# Altium schematic sheet programmer_adaptor.SchDoc: Programmer Adaptor
size 431 x 279 mm; Date: 19/05/2021; DrawnBy: Steven Wong; SheetNumber: 1; SheetTotal: 1; Project: World Wide Mide; ProjectRev: 02; DocumentRev: A; ItemRev: A
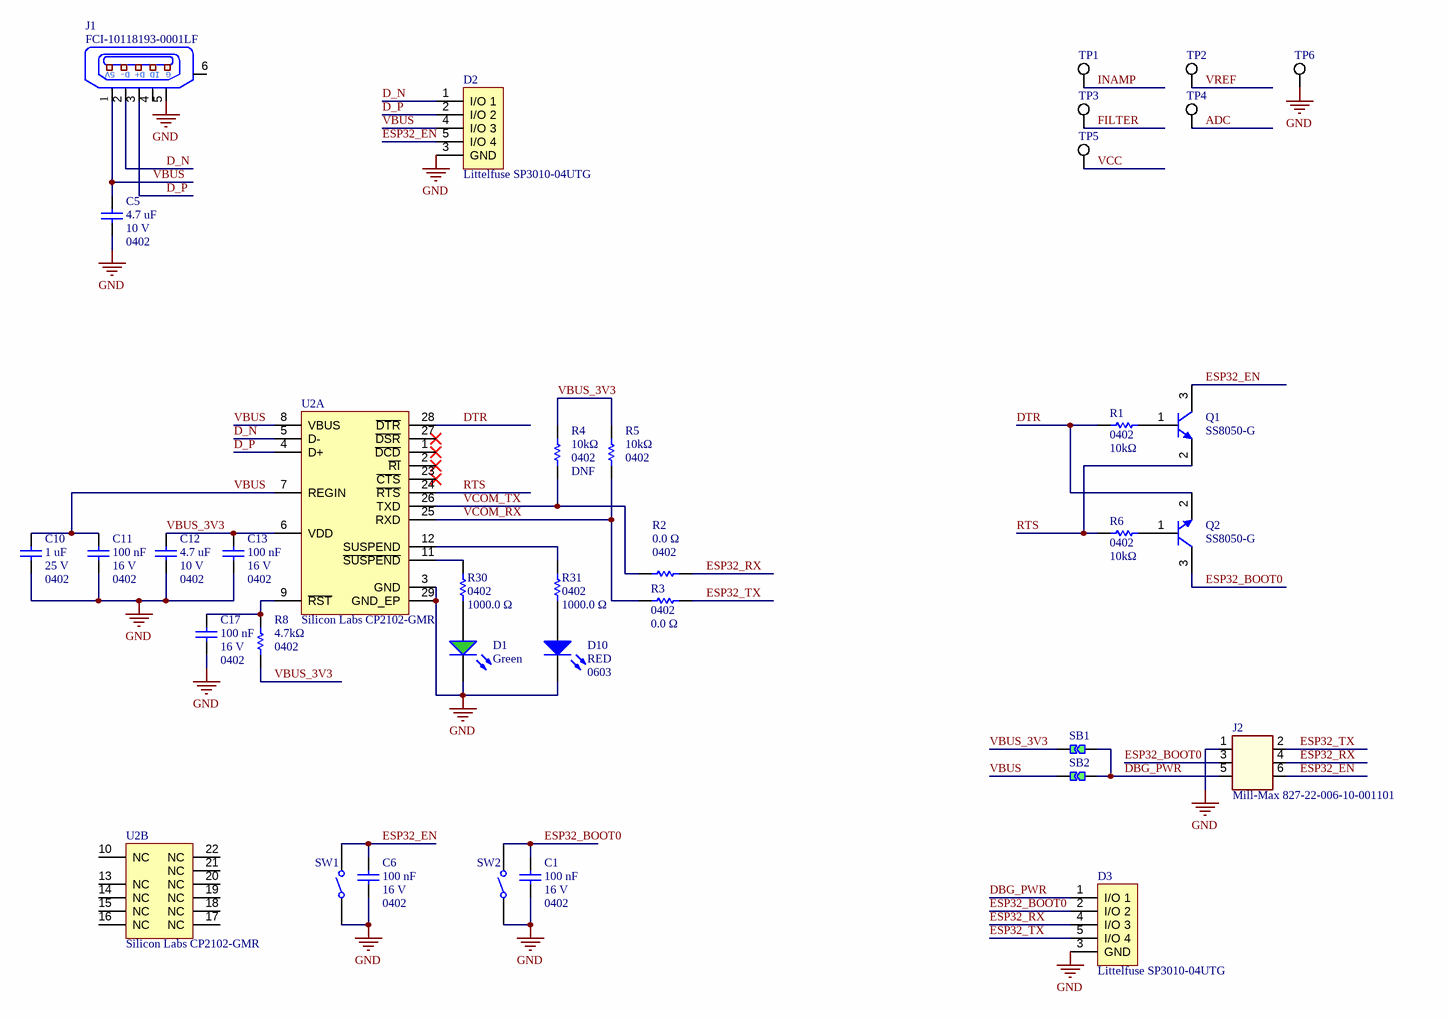
[diagram p0: programmer_adaptor.SchDoc]

## Parts
(Parts that share a designator on the sheet are numbered #1, #2 ... from top to bottom, then left to right.)
C1  Capacitance: 100 nF  Case/Package: 0402  Voltage Rating: 16 V  [CAPC1005X56X25NL10T15]  (hidden comment: 100nF)
C5  Package: 0402  Capacitance: 4.7 uF  Voltage Rating (DC): 10 V  [PCB-ly623x0ckhe065kxsmmc-1]  (hidden comment: Samsung CL05A475MP5NRNC)
C6  Capacitance: 100 nF  Case/Package: 0402  Voltage Rating: 16 V  [CAPC1005X56X25NL10T15]  (hidden comment: 100nF)
C10  Package: 0402  Voltage Rating (DC): 25 V  Capacitance: 1 uF  [PCB-515da9ytrm2wahx6tw11-1]  (hidden comment: Samsung CL05A105KA5NQNC)
C11  Capacitance: 100 nF  Case/Package: 0402  Voltage Rating: 16 V  [CAPC1005X56X25NL10T15]  (hidden comment: 100nF)
C12  Package: 0402  Capacitance: 4.7 uF  Voltage Rating (DC): 10 V  [PCB-ly623x0ckhe065kxsmmc-1]  (hidden comment: Samsung CL05A475MP5NRNC)
C13  Capacitance: 100 nF  Case/Package: 0402  Voltage Rating: 16 V  [CAPC1005X56X25NL10T15]  (hidden comment: 100nF)
C17  Capacitance: 100 nF  Case/Package: 0402  Voltage Rating: 16 V  [CAPC1005X56X25NL10T15]  (hidden comment: 100nF)
D1  Green  [PCB-qrh50x9m6cshxb6d9t7t-1]
D2  Littelfuse SP3010-04UTG  [CAF-50P250X100-10N]
D3  Littelfuse SP3010-04UTG  [CAF-50P250X100-10N]
D10  RED  Case/Package: 0603  [PCB-w5d6ij34fe7jw11ooj6d-1]
J1  FCI-10118193-0001LF  [PCB-no442bxfm6el1a6nc6pa-1]
J2  Mill-Max 827-22-006-10-001101  [PCB-1cajzzw71vgb0kstyzhz-1]
Q1  Manufacturer Part Number: SS8050-G  [PCB-tafg2djhou6mrz6nnzkw-1]  (hidden comment: NPN)
Q2  Manufacturer Part Number: SS8050-G  [PCB-tafg2djhou6mrz6nnzkw-1]  (hidden comment: NPN)
R1  Case/Package: 0402  Resistance: 10kΩ  [RESC1005X40X25NL05T10]  (hidden comment: Yageo / Phycomp RC0402FR-1310KL)
R2  Case/Package: 0402  Resistance: 0.0 Ω  [RESC1005X37X25NL05T10]  (hidden comment: Yageo AC0402JR-070RL)
R3  Case/Package: 0402  Resistance: 0.0 Ω  [RESC1005X37X25NL05T10]  (hidden comment: Yageo AC0402JR-070RL)
R4  Case/Package: 0402  Resistance: 10kΩ  Fit: DNF  [RESC1005X40X25NL05T10]  (hidden comment: Yageo / Phycomp RC0402FR-1310KL)
R5  Case/Package: 0402  Resistance: 10kΩ  [RESC1005X40X25NL05T10]  (hidden comment: Yageo / Phycomp RC0402FR-1310KL)
R6  Case/Package: 0402  Resistance: 10kΩ  [RESC1005X40X25NL05T10]  (hidden comment: Yageo / Phycomp RC0402FR-1310KL)
R8  Case/Package: 0402  Resistance: 4.7kΩ  [RESC1005X40X25NL05T10]  (hidden comment: Vishay Dale CRCW04024K70FKEDHP)
R30  Case/Package: 0402  Resistance: 1000.0 Ω  [RESC1005X40X25LL10T10]  (hidden comment: KOA Speer RK73H1ETTP1001F)
R31  Case/Package: 0402  Resistance: 1000.0 Ω  [RESC1005X40X25LL10T10]  (hidden comment: KOA Speer RK73H1ETTP1001F)
SB1  Solder Bridge 0402  [PCB-zgo6wgtf9tfvr4qcvek3-1]  (value not drawn)
SB2  Solder Bridge 0402  [PCB-zgo6wgtf9tfvr4qcvek3-1]  (value not drawn)
SW1  TS-1185-C-A-A-A  [PCB-qarcnbrnejma51b9hfzm-1]  (value not drawn)
SW2  TS-1185-C-A-A-A  [PCB-qarcnbrnejma51b9hfzm-1]  (value not drawn)
TP1  Keystone Electronics 5002  [TEST_LOOP]  (value not drawn)
TP2  Keystone Electronics 5002  [TEST_LOOP]  (value not drawn)
TP3  Keystone Electronics 5002  [TEST_LOOP]  (value not drawn)
TP4  Keystone Electronics 5002  [TEST_LOOP]  (value not drawn)
TP5  Keystone Electronics 5002  [TEST_LOOP]  (value not drawn)
TP6  Keystone Electronics 5002  [TEST_LOOP]  (value not drawn)
U2#1  Silicon Labs CP2102-GMR  [QFN50P500X500X100_HS-29N]  (part A of 2)
U2#2  Silicon Labs CP2102-GMR  [QFN50P500X500X100_HS-29N]  (part B of 2)

## Nets
GND: C1.2 C5.1 C6.2 C10.1 C11.2 C12.1 C13.2 C17.2 D1.2(K) D2.3(GND) D3.3(GND) D10.2(K) J1.5 J2.1 SW1.1 SW2.1 TP6.1 U2#1.3(GND) U2#1.29(GND_EP)
ADC: TP4.1
D_N: D2.1(I/O_1) J1.2 U2#1.5(D-)
D_P: D2.2(I/O_2) J1.3 U2#1.4(D+)
DBG_PWR: D3.1(I/O_1) J2.5 SB1.2 SB2.2
DTR: Q2.2(E) R1.2 U2#1.28(~{DTR})
ESP32_BOOT0: C1.1 D3.2(I/O_2) J2.3 Q2.3(C) SW2.2
ESP32_EN: C6.1 D2.5(I/O_4) J2.6 Q1.3(C) SW1.2
ESP32_RX: D3.4(I/O_3) J2.4 R2.1
ESP32_TX: D3.5(I/O_4) J2.2 R3.2
FILTER: TP3.1
INAMP: TP1.1
RTS: Q1.2(E) R6.2 U2#1.24(~{RTS})
VBUS: C5.2 C10.2 C11.1 D2.4(I/O_3) J1.1 SB2.1 U2#1.7(REGIN) U2#1.8(VBUS)
VBUS_3V3: C12.2 C13.1 R4.2 R5.2 R8.2 SB1.1 U2#1.6(VDD)
VCC: TP5.1
VCOM_RX: R3.1 R5.1 U2#1.25(RXD)
VCOM_TX: R2.2 R4.1 U2#1.26(TXD)
VREF: TP2.1
NetC17_1: C17.1 R8.1 U2#1.9(~{RST})
NetD1_1: D1.1(A) R30.2
NetD10_1: D10.1(A) R31.2
NetQ1_1: Q1.1(B) R1.1
NetQ2_1: Q2.1(B) R6.1
NetR30_1: R30.1 U2#1.11(~{SUSPEND})
NetR31_1: R31.1 U2#1.12(SUSPEND)

Not connected (* = marked no-connect by the designer): J1 4 6; U2#1 1(~{DCD})* 2(~{RI})* 23(~{CTS})* 27(~{DSR})*; U2#2 10(NC) 13(NC) 14(NC) 15(NC) 16(NC) 17(NC) 18(NC) 19(NC) 20(NC) 21(NC) 22(NC)

## Notes on the sheet
- PROJECT
- TITLE
- PROJECT REVISION:
- DOCUMENT REVISION:
- DATE:
- Drawn by:
- SIZE
- B
- FILE NAME
- SHEET
- OF
- REV
- This work is licensed under a Creative Commons Attribution-ShareAlike 4.0 International License.
- (in symbol CMP-b7d77f99eeaa6810-13) 5V; D-; D+; ID; G

## Library data of the parts
C1 C6 C11 C13 C17 = CMP-bf2276a55d9a60e5-19: Ceramic capacitor SMD-0402 100nF /16V X7R# K +-10%, Samsung, RoHS; Dielectric Characteristic: X7R; Lead-Free Status: Lead Free; Mounting Style: Surface Mount; OctopartID: 0755ced2c795d892; LCSC Part #: C1525
C5 C12 = CMP-45408d1ae5db9a87-3: Cap Ceramic 4.7uF 10V X5R 20% SMD 0402 85°C Paper T/R; Lead-Free Status: Lead Free; Octopart URL: https://octopart.com/cl05a475mp5nrnc-samsung-22054397; Manufacturer Part Number: CL05A475MP5NRNC; RoHS: Compliant; OctopartID: 45408d1ae5db9a87; LCSC Part #: C23733
C10 = CMP-8f214705328650e6-4: Cap Ceramic 1uF 25V X5R 10% SMD 0402 85°C Cardboard T/R; Lead-Free Status: Lead Free; Octopart URL: https://octopart.com/cl05a105ka5nqnc-samsung-19830977; Manufacturer Part Number: CL05A105KA5NQNC; RoHS: Compliant; OctopartID: 8f214705328650e6; LCSC Part #: C52923
D1 = CMP-7093b92408b7af54-1: LED SMD Top View Uni-Color Brilliant Green 518nm 0603 Pkg ø7T/R 3k"; OctopartID: 7093b92408b7af54; Octopart URL: https://octopart.com/19-217%2Fghc-yr1s2%2F3t-everlight-12410178; LCSC Part #: C72043
D2 D3 = CMP-8bbd427616b0547a-5: SP3010 Series 12.3 V 3 A 0.45 pF Quad Uni-Directional TVS Diode Array - UDFN-10; LCSC Part #: C94394
D10 = CMP-a33c6a36c6057cfb-1: Red 0603 1.6 x 0.8 mm 160° Diffused 14 mcd 2 V PCB Chip Surface Mount LED; Manufacturer Part Number: SML-LX0603IW-TR; Wavelength: 635 nm; Lead-Free Status: Lead Free; Case/Package (SI): 1608; Luminous Intensity: 14.0 mcd; Forward Voltage: 2.00 V; RoHS: Compliant; Packaging: Cut Tape (CT), Tape & Reel (TR); Size-Width: 1.60 mm; Peak Wavelength: 635 nm; Viewing Angle: 160 °; Operating Temperature: 85.0 °C (max); Octopart URL: https://octopart.com/sml-lx0603iw-tr-lumex-16479; Number of Pins: 2; Color: Red; OctopartID: a33c6a36c6057cfb; Lens Type: Diffused; LCSC Part #: C2286
J1 = CMP-b7d77f99eeaa6810-13: Conn Micro USB Type B RCP 5 POS 0.65mm Solder RA SMD 5 Terminal 1 Port T/R; RoHS: Compliant; Contact Material: Copper Alloy
J2 = CMP-e3db2be582e23c1c-3: Conn Spring Loaded Connector HDR 6 POS 2.54mm Solder ST Thru-Hole Tube; System: Connector
Q1 Q2 = CMP-1301de72f0beccc6-3: Trans Gp Bjt NPN 25V 1.5A 300MW 3-PIN SOT-23 T/r; Octopart URL: https://octopart.com/ss8050-g-comchip-75089625; OctopartID: 1301de72f0beccc6
  Q1: LCSC Part #: C164886
R1 R4-R6 = CMP-3661304-2: Thick Film Resistors - SMD 10K OHM 1%; Lead-Free Status: Lead Free; Power Rating: 0.0625 W; Voltage Rating (DC): 50.0 V; Mounting Style: Surface Mount; Number of Pins: 2; Octopart Url: https://octopart.com/rc0402fr-1310kl-yageo-42863452; OctopartID: f5673ee3db5d2aa0; Packaging: Cut Tape (CT); Resistance Tolerance: ±1%; RoHS: Compliant; Size-Length: 0.001 m; Manufacturer Part Number: RC0402FR-1310KL; LCSC Part #: C25744
  R1 R5 R6: Fit: Fit
R2 R3 = CMP-1900348-2: RES SMD 0.0 OHM JUMPER 1/16W; Lead-Free Status: Lead Free; Resistance Tolerance: ±5%; Manufacturer Part Number: AC0402JR-070RL; Mounting Style: Surface Mount; Octopart Url: https://octopart.com/ac0402jr-070rl-yageo-21711084; OctopartID: 9e9b56daf311415c; RoHS: Compliant; LCSC Part #: C17168
R8 = CMP-1859046-2: Thick Film Resistors - SMD 1/8watt 4.7Kohms 1% 100ppm High Power; Lead-Free Status: Lead Free; Power Rating: 0.063 W; Octopart Url: https://octopart.com/crcw04024k70fkedhp-vishay+dale-44383120; OctopartID: 931e58b18de84cd9; Resistance Tolerance: ±1%; RoHS: Compliant; Manufacturer Part Number: CRCW04024K70FKEDHP; LCSC Part #: C25900
R30 R31 = CMP-2823544-2: Res Thick Film 0402 1K Ohm 1% 0.063W(1/16W) ±100ppm/C Molded SMD Automotive Punched Paper T/R; Lead-Free Status: Lead Free; Temperature Coefficient: 100.0 ppm/°C; Voltage Rating (DC): 50.0 V; Octopart Url: https://octopart.com/rk73h1ettp1001f-koa+speer-2165773; OctopartID: 54d59dfe7dbe8b12; Power Rating: 0.063 W; Resistance Tolerance: ±1%; RoHS: Compliant; Size-Length: 0.001 m; Size-Width: 0.0005 m; Manufacturer Part Number: RK73H1ETTP1001F; LCSC Part #: C11702
SB1 SB2 = CMP-p5m5ndkvhoystooqawk9-2: Solder Bridge Jumper, can be fitted with 0402 0R resistor for automated production; State: Open / Closed; CustomComponentID: p5m5ndkvhoystooqawk9
SW1 SW2 = CMP-hgui3ccx9uakpoe7vbsx-5: SPST 50mA @ 12VDC Vertical Round Button 260gf SMD Tactile Switches RoHS; Manufacturer: XKB Connectivity; LCSC Part #: C561518; Manufacturer Part Number: TS-1185-C-A-A-A; CustomComponentID: hgui3ccx9uakpoe7vbsx; Homepage URL: https://lcsc.com/product-detail/Tactile-Switches_XKB-Connectivity-TS-1185-C-A-A-A_C561518.html
TP1-TP6 = CMP-954155-2: KEYSTONE   5002   Series:-; Manufacturer Part Number: 5002; Lead-Free Status: Lead Free; Color: White; Contact Material: Phosphor Bronze; Contact Plating: Tin; Octopart Url: https://octopart.com/5002-keystone-5193; OctopartID: f34a3a40c2652c8d; Packaging: Bag; REACH SVHC Compliance: No SVHC; RoHS: Compliant; Size-Diameter: 0.00254 m; Size-Height: 0.00762 m; Size-Inner Diameter: 0.00127 m; Size-Length: 0.00762 m
U2#1 U2#2 = CMP-1313603-13: Microcontroller Solutions - Interface Products USB-TO-UART BRIDGE; Lead-Free Status: Lead Free; Supply Current: 100 mA; Supply Voltage (DC): 3.00 V (min), 3.60 V (max); Octopart URL: https://octopart.com/cp2102-gmr-silicon+labs-713744; Manufacturer Part Number: CP2102-GMR; Case/Package: MLP; Mounting Style: Surface Mount; Operating Temperature: -40.0 °C (min); Packaging: Reel; RoHS: Compliant; OctopartID: 97e45ee456924823
  U2#1: LCSC Part #: C6568